# EAGLE design xbee_to_avr (EAGLE 5.06)
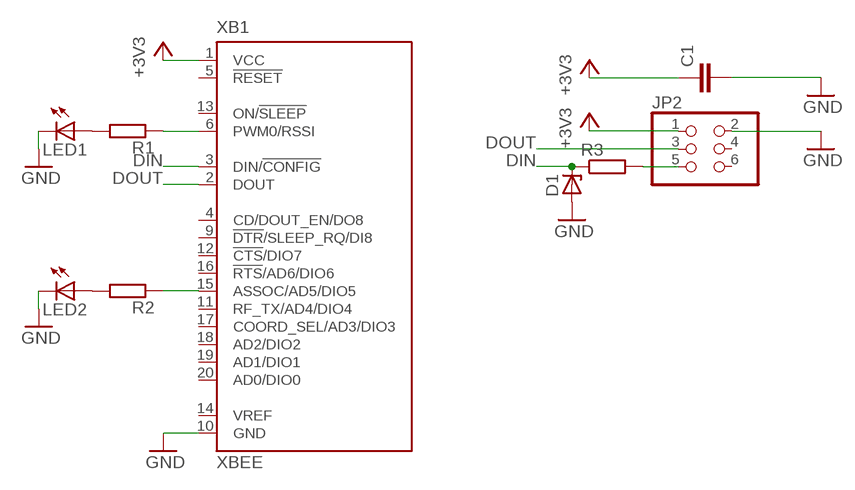
[diagram p0: schematic, sheet 1]

## Parts
C1  C-EU050-024X044  [C050-024X044]
D1  ZENER-DIODEDO35Z10  [DO35Z10]
JP2  PINHD-2X3  [2X03]
LED1  LED3MM  [LED3MM]
LED2  LED3MM  [LED3MM]
R1  R-EU_0207/10  [0207/10]
R2  R-EU_0207/10  [0207/10]
R3  R-EU_0207/10  [0207/10]
XB1  XBEE  [XBEE]

## Nets
+3V3: C1.1 JP2.1 XB1.1(VCC)
DIN: D1.C R3.1 XB1.3(DIN/!CONFIG)
DOUT: JP2.3 XB1.2(DOUT)
GND: C1.2 D1.A JP2.2 LED1.K(C) LED2.K(C) XB1.10(GND)
N$1: JP2.5 R3.2
N$7: LED1.A R1.2
N$8: LED2.A R2.2
N$9: R1.1 XB1.6(PWM0/RSSI)
N$10: R2.1 XB1.15(ASSOC/AD5/DIO5)
Unconnected: JP2.4 JP2.6 XB1.4(CD/DOUT_EN/DO8) XB1.5(!RESET) XB1.9(!DTR!/SLEEP_RQ/DI8) XB1.11(RF_TX/AD4/DIO4) XB1.12(!CTS!/DIO7) XB1.13(ON/!SLEEP) XB1.14(VREF) XB1.16(!RTS!/AD6/DIO6) XB1.17(COORD_SEL/AD3/DIO3) XB1.18(AD2/DIO2) XB1.19(AD1/DIO1) XB1.20(AD0/DIO0)

## Library data of the parts
C1 = rcl:C-EU: CAPACITOR, European symbol
D1 = diode:ZENER-DIODE: Z-Diode
JP2 = pinhead:PINHD-2X3: PIN HEADER
LED1 LED2 = led:LED: LED OSRAM: - CHIPLED LG R971, LG N971, LY N971, LG Q971, LY Q971, LO R971, LY R971 LH N974, LH R974 LS Q976, LO Q976, LY Q976 LO Q996 - Hyper CHIPLED LW Q18S LB Q993, LB Q99A, LB R99A - SideLED LS A670, LO A670, LY A670, LG A670, LP A670 LB A673, LV A673, LT A673, LW A673 LH A674 LY A675 LS A676, LA A676, LO A676, LY A676, LW A676 LS A679, LY A679, LG A679 - Hyper Micro SIDELED® LS Y876, LA Y876, LO Y876, LY Y876 LT Y87S - SmartLED LW L88C, LW L88S LB L89C, LB L89S, LG L890 LS L89K, LO L89K, LY L89K LS L896, LA L896, LO L896, LY L896 - TOPLED LS T670, LO T670, LY T670, LG T670, LP T670 LSG T670, LSP T670, LSY T670, LOP T670, LYG T670 LG T671, LOG T671, LSG T671 LB T673, LV T673, LT T673, LW T673 LH T674 LS T676, LA T676, LO T676, LY T676, LB T676, LH T676, LSB T676, LW T676 LB T67C, LV T67C, LT T67C, LS T67K, LO T67K, LY T67K, LW E67C LS E67B, LA E67B, LO E67B, LY E67B, LB E67C, LV E67C, LT E67C LW T67C LS T679, LY T679, LG T679 LS T770, LO T770, LY T770, LG T770, LP T770 LB T773, LV T773, LT T773, LW T773 LH T774 LS E675, LA E675, LY E675, LS T675 LS T776, LA T776, LO T776, LY T776, LB T776 LHGB T686 LT T68C, LB T68C - Hyper Mini TOPLED® LB M676 - Mini TOPLED Santana® LG M470 LS M47K, LO M47K, LY M47K Source: http://www.osram.convergy.de LUXEON: - LUMILED® LXK2-PW12-R00, LXK2-PW12-S00, LXK2-PW14-U00, LXK2-PW14-V00 LXK2-PM12-R00, LXK2-PM12-S00, LXK2-PM14-U00 LXK2-PE12-Q00, LXK2-PE12-R00, LXK2-PE12-S00, LXK2-PE14-T00, LXK2-PE14-U00 LXK2-PB12-K00, LXK2-PB12-L00, LXK2-PB12-M00, LXK2-PB14-N00, LXK2-PB14-P00, LXK2-PB14-Q00 LXK2-PR12-L00, LXK2-PR12-M00, LXK2-PR14-Q00, LXK2-PR14-R00 LXK2-PD12-Q00, LXK2-PD12-R00, LXK2-PD12-S00 LXK2-PH12-R00, LXK2-PH12-S00 LXK2-PL12-P00, LXK2-PL12-Q00, LXK2-PL12-R00 Source: www.luxeon.com KINGBRIGHT: KA-3528ASYC Source: www.kingbright.com
R1-R3 = rcl:R-EU_: RESISTOR, European symbol
XB1 = maxstream:XBEE: XBee (TM) /XBee-PRO(TM) OEM RF Modules Source: MaxStream, Inc. xbee_productmanual.pdf

## Board
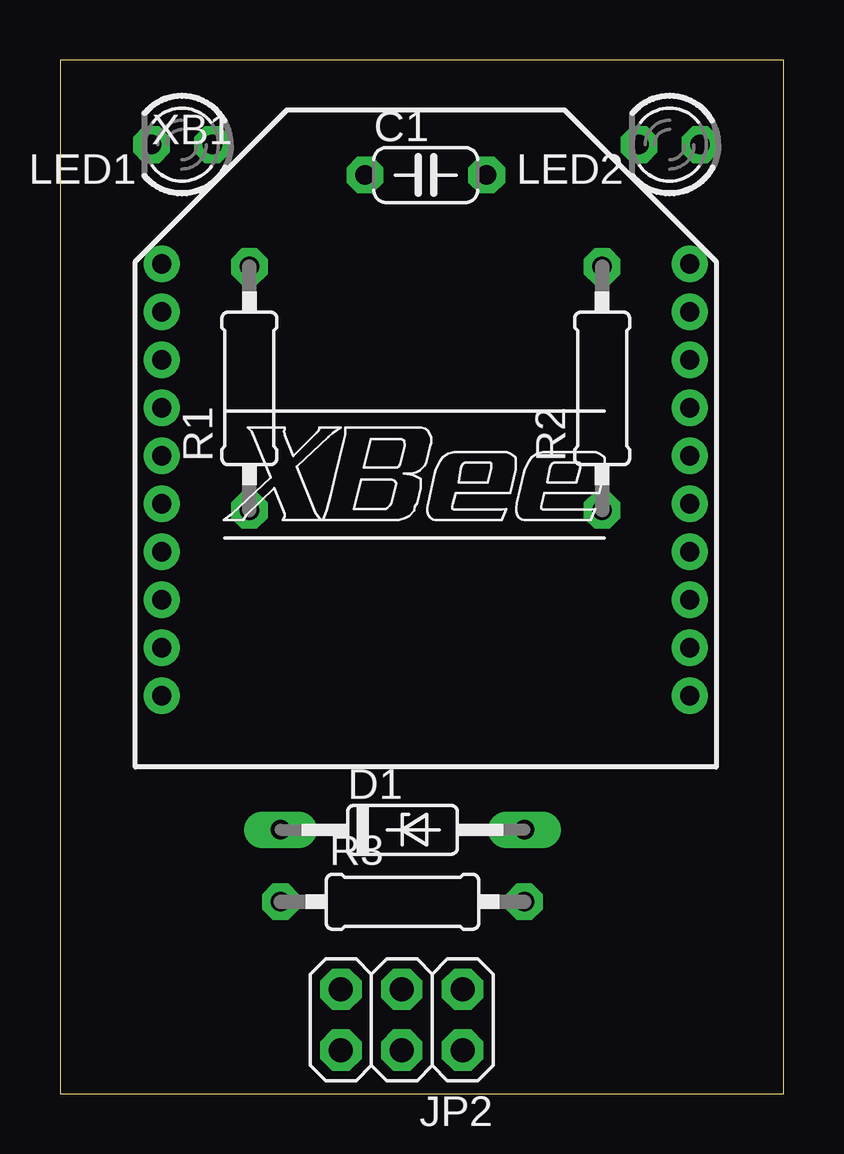
[diagram p1: board, top side]
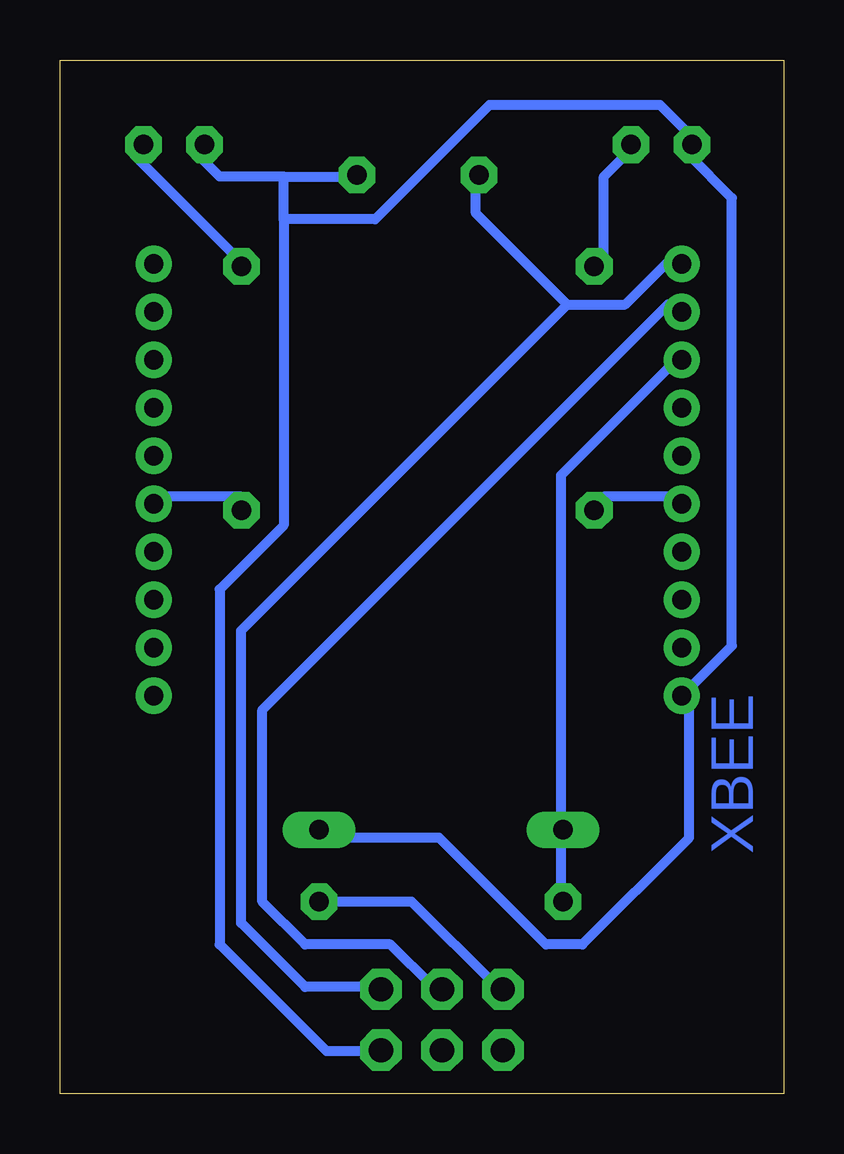
[diagram p2: board, bottom side, seen from below]

Size 30.15 x 43.09 mm. Coordinates in mm from the lower left corner, seen from the top.
Outline: 0,0 30.15,0 30.15,43.09 0,43.09 0,0
Copper layers (1*16): Top 0.035mm / dielectric 1.5mm / Bottom 0.035mm
Design rules "default *": minimum track width 16mil, minimum drill 24mil, track to track 13mil, track to pad 13mil, pad to pad 13mil, via to via 13mil, smd to smd 8mil, copper to edge 40mil, drill to drill 8mil, minimum pad ring 14mil, minimum via ring 15mil, stop-mask expansion 4mil, vias tented up to drill 0mil, thermal gap 10mil

### Footprints (pad centres in the part's own frame; a part is rotated, then mirrored left to right if it is on the bottom)
C050-024X044 = drill 0.813 octagon: 1 -2.54,0; 2 2.54,0
DO35Z10 = drill 0.813 long: A 5.08,0; C -5.08,0
2X03 = drill 1.016 octagon: 1 -2.54,-1.27; 2 -2.54,1.27; 3 0,-1.27; 4 0,1.27; 5 2.54,-1.27; 6 2.54,1.27
LED3MM = drill 0.813 octagon: A -1.27,0; K 1.27,0
0207/10 = drill 0.813 octagon: 1 -5.08,0; 2 5.08,0
XBEE = drill 0.8 pad 1.27 round: 1 -11,9; 2 -11,7; 3 -11,5; 4 -11,3; 5 -11,1; 6 -11,-1; 7 -11,-3; 8 -11,-5; 9 -11,-7; 10 -11,-9; 11 11,-9; 12 11,-7; 13 11,-5; 14 11,-3; 15 11,-1; 16 11,1; 17 11,3; 18 11,5; 19 11,7; 20 11,9

### Placement (x,y rotation side)
C1  15.24,38.29 0 top
D1  14.27,11 0 top
JP2  14.24,3.08 180 top
LED1  5.08,39.56 180 top
LED2  25.4,39.56 180 top
R1  7.89,29.4 90 top
R2  22.59,29.4 90 top
R3  14.27,8 0 top
XB1  15.24,25.59 0 top

### Tracks (layer width: path | path; a pad name or v marks a point on that pad's centre or on a via)
+3V3
  Bottom 0.406: 9.02,32.89 6.6,32.89 4.83,34.67 XB1.1 | 9.02,32.89 12.83,36.7 12.83,38.23 C1.1 | 9.02,32.89 22.61,19.3 22.61,7.11 19.94,4.45 17.27,4.45 JP2.1
DIN
  Bottom 0.406: XB1.3 4.83,30.23 9.27,25.78 9.27,11.56 D1.C 9.27,10.67 9.27,8 R3.1
DOUT
  Bottom 0.406: XB1.2 4.83,32.89 21.72,16 21.72,8 19.94,6.22 16.38,6.22 14.61,4.45 JP2.3
GND
  Bottom 0.406: 20.83,38.23 23.5,38.23 24.38,39.12 LED2.K | 20.83,38.23 18.16,38.23 C1.2 | 20.83,36.45 20.83,38.23 | 20.83,36.45 20.83,23.69 23.5,21.02 23.5,6.22 19.05,1.78 17.27,1.78 JP2.2 | D1.A 19.05,10.67 14.35,10.67 9.91,6.22 8.38,6.22 3.94,10.67 3.94,16 XB1.10 3.94,16.89 2.16,18.67 2.16,37.34 3.94,39.12 LED1.K 3.94,40.01 5.14,41.21 12.26,41.21 17.02,36.45 20.83,36.45
N$1
  Bottom 0.406: R3.2 19.05,8 15.49,8 11.94,4.45 JP2.5
N$7
  Bottom 0.406: R1.2 7.49,34.67 7.49,38.23 6.6,39.12 LED1.A
N$8
  Bottom 0.406: R2.2 22.61,34.67 27.05,39.12 LED2.A
N$9
  Bottom 0.406: XB1.6 4.83,24.89 7.49,24.89 R1.1
N$10
  Bottom 0.406: XB1.15 26.16,24.89 22.61,24.89 R2.1

### Text on the board
Bottom: XBEE